# EAGLE design 3rd.try (EAGLE 5.06)
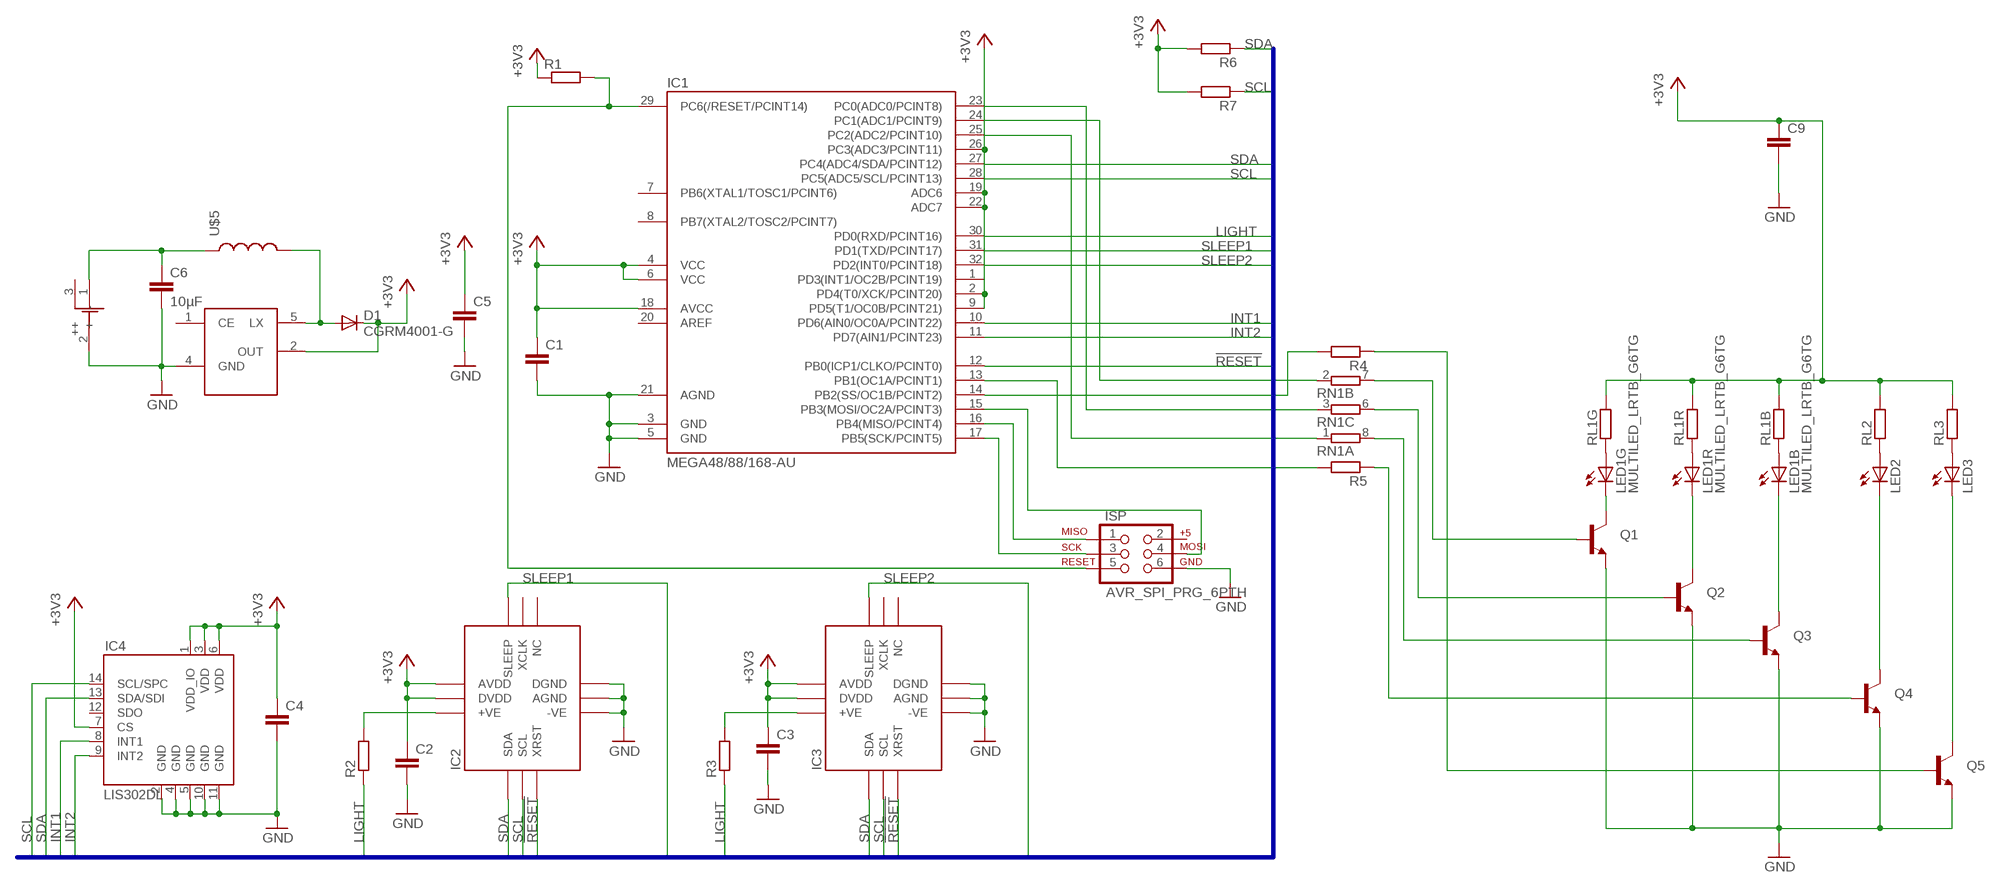
[diagram p0: schematic, sheet 1]

## Parts
C1  C-EUC0402  [C0402]
C2  C-EUC0402  [C0402]
C3  C-EUC0402  [C0402]
C4  C-EUC0402  [C0402]
C5  C-EUC0805  [C0805]
C6  10µF  C-EUC1206  [C1206]
C9  C-EUC0805  [C0805]
D1  CGRM4001-G  [SOD-123_MINI-SMA]
IC1  MEGA48/88/168-AU  [TQFP32-08]
IC2  ADJD_COLOR_SENSOR_SMD  [ADJD-S371]
IC3  ADJD_COLOR_SENSOR_SMD  [ADJD-S371]
IC4  LIS302DL  [LGA14]
ISP  AVR_SPI_PRG_6PTH  [2X3]
LED1  MULTILED_LRTB_G6TG  [P-LCC-6_TOPLED]
LED2  LEDCHIPLED_0603  [CHIPLED_0603]
LED3  LEDCHIPLED_0603  [CHIPLED_0603]
Q1  TRANSISTOR_NPNSOT23  [SOT23]
Q2  TRANSISTOR_NPNSOT23  [SOT23]
Q3  TRANSISTOR_NPNSOT23  [SOT23]
Q4  TRANSISTOR_NPNSOT23  [SOT23]
Q5  TRANSISTOR_NPNSOT23  [SOT23]
R1  R-EU_R0603  [R0603]
R2  R-EU_R0603  [R0603]
R3  R-EU_R0603  [R0603]
R4  R-EU_R0603  [R0603]
R5  R-EU_R0603  [R0603]
R6  R-EU_R0603  [R0603]
R7  R-EU_R0603  [R0603]
RL1B  R-EU_R0805  [R0805]
RL1G  R-EU_R0805  [R0805]
RL1R  R-EU_R0805  [R0805]
RL2  R-EU_R0603  [R0603]
RL3  R-EU_R0603  [R0603]
RN1  4R-NCAY16  [CAY16]
U$2  BATT  [BATTCOM_20MM_PTH]
U$4  NCP1402  [SOT23-5]
U$5  INDUCTORCDRH62B  [CDRH62BNP-470MC]

## Nets
!RESET: IC1.12(PB0(ICP1/CLKO/PCINT0)) IC2.10(XRST) IC3.10(XRST)
+3V3: C1.1 C2.1 C3.1 C4.1 C5.1 C9.1 D1.C IC1.2(PD4(T0/XCK/PCINT20)) IC1.4(VCC) IC1.6(VCC) IC1.9(PD5(T1/OC0B/PCINT21)) IC1.18(AVCC) IC1.19(ADC6) IC1.22(ADC7) IC1.26(PC3(ADC3/PCINT11)) IC2.5(DVDD) IC2.7(AVDD) IC3.5(DVDD) IC3.7(AVDD) IC4.1(VDD_IO) IC4.3(VDD) IC4.6(VDD) IC4.7(CS) R1.1 R6.2 R7.2 RL1B.2 RL1G.2 RL1R.2 RL2.2 RL3.2 U$4.2(OUT)
GND: C1.2 C2.2 C3.2 C4.2 C5.2 C6.2 C9.2 IC1.3(GND) IC1.5(GND) IC1.21(AGND) IC2.1(-VE) IC2.9(AGND) IC2.11(DGND) IC3.1(-VE) IC3.9(AGND) IC3.11(DGND) IC4.2(GND) IC4.4(GND) IC4.5(GND) IC4.10(GND) IC4.11(GND) ISP.6 Q1.2(E) Q2.2(E) Q3.2(E) Q4.2(E) Q5.2(E) U$2.2(-) U$4.4(GND)
INT1: IC1.10(PD6(AIN0/OC0A/PCINT22)) IC4.8(INT1)
INT2: IC1.11(PD7(AIN1/PCINT23)) IC4.9(INT2)
LIGHT: IC1.30(PD0(RXD/PCINT16)) R2.1 R3.1
N$1: IC1.29(PC6(/RESET/PCINT14)) ISP.5 R1.2
N$2: IC1.25(PC2(ADC2/PCINT10)) RN1.1
N$5: IC1.17(PB5(SCK/PCINT5)) ISP.3
N$6: IC1.16(PB4(MISO/PCINT4)) ISP.1
N$10: LED1.C2(G:C) Q1.3(C)
N$11: LED1.C1(R:C) Q2.3(C)
N$12: LED1.C3(B:C) Q3.3(C)
N$13: IC2.3(+VE) R2.2
N$14: IC3.3(+VE) R3.2
N$15: IC1.15(PB3(MOSI/OC2A/PCINT3)) ISP.4
N$16: C6.1 U$2.1(+) U$5.P$1
N$18: LED1.A2(G:A) RL1G.1
N$19: IC1.24(PC1(ADC1/PCINT9)) RN1.2
N$20: D1.A U$4.5(LX) U$5.P$2
N$22: Q1.1(B) RN1.7
N$23: IC1.23(PC0(ADC0/PCINT8)) RN1.3
N$24: Q2.1(B) RN1.6
N$26: Q3.1(B) RN1.8
N$27: LED1.A1(R:A) RL1R.1
N$28: LED2.C Q4.3(C)
N$29: LED3.C Q5.3(C)
N$30: LED1.A3(B:A) RL1B.1
N$31: LED2.A RL2.1
N$32: LED3.A RL3.1
N$33: Q4.1(B) R5.1
N$34: Q5.1(B) R4.1
N$35: IC1.14(PB2(SS/OC1B/PCINT2)) R4.2
N$36: IC1.13(PB1(OC1A/PCINT1)) R5.2
SCL: IC1.28(PC5(ADC5/SCL/PCINT13)) IC2.6(SCL) IC3.6(SCL) IC4.14(SCL/SPC) R7.1
SDA: IC1.27(PC4(ADC4/SDA/PCINT12)) IC2.4(SDA) IC3.4(SDA) IC4.13(SDA/SDI) R6.1
SLEEP1: IC1.31(PD1(TXD/PCINT17)) IC2.8(SLEEP)
SLEEP2: IC1.32(PD2(INT0/PCINT18)) IC3.8(SLEEP)
Unconnected: IC1.1(PD3(INT1/OC2B/PCINT19)) IC1.7(PB6(XTAL1/TOSC1/PCINT6)) IC1.8(PB7(XTAL2/TOSC2/PCINT7)) IC1.20(AREF) IC2.2(NC) IC2.12(XCLK) IC3.2(NC) IC3.12(XCLK) IC4.12(SDO) ISP.2 RN1.4 RN1.5 U$2.3(++) U$4.1(CE)

## Buses
COLOR:SDA,SCL,!RESET,LIGHT,SLEEP1,SLEEP2,INT1,INT2

## Library data of the parts
C1-C6 C9 = rcl:C-EU: CAPACITOR, European symbol
D1 = diode:CGRM400*-G: Molded plasitc,JEDEC SOD-123/Mini SMA Source: Comchip CGRM4001-G.pdf
IC1 = avr-4:MEGA48/88/168
IC2 IC3 = SparkFun:ADJD_COLOR_SENSOR: Color Light Sensor ADJD-S371 from Avago. Digital RGB light sensor (I2C) with on-board white LED. Not quite proven footprint or schematic component. SKU: COM-08618
IC4 = SparkFunB:LIS302DL
ISP = SparkFun:AVR_SPI_PRG_6: AVR ISP 6 Pin This is the reduced ISP connector for AVR programming. Common on Arduino. This footprint will take up less PCB space and can be used with a 10-pin to 6-pin adapter such as SKU: BOB-08508
LED1 = led:MULTILED_LRTB_G6TG: 6-lead MULTILED® Enhanced optical Power LED (ThinFilm® / ThinGaN®) Source. OSRAM - LRTB_G6TG.pdf
LED2 LED3 = led:LED: LED OSRAM: - CHIPLED LG R971, LG N971, LY N971, LG Q971, LY Q971, LO R971, LY R971 LH N974, LH R974 LS Q976, LO Q976, LY Q976 LO Q996 - Hyper CHIPLED LW Q18S LB Q993, LB Q99A, LB R99A - SideLED LS A670, LO A670, LY A670, LG A670, LP A670 LB A673, LV A673, LT A673, LW A673 LH A674 LY A675 LS A676, LA A676, LO A676, LY A676, LW A676 LS A679, LY A679, LG A679 - Hyper Micro SIDELED® LS Y876, LA Y876, LO Y876, LY Y876 LT Y87S - SmartLED LW L88C, LW L88S LB L89C, LB L89S, LG L890 LS L89K, LO L89K, LY L89K LS L896, LA L896, LO L896, LY L896 - TOPLED LS T670, LO T670, LY T670, LG T670, LP T670 LSG T670, LSP T670, LSY T670, LOP T670, LYG T670 LG T671, LOG T671, LSG T671 LB T673, LV T673, LT T673, LW T673 LH T674 LS T676, LA T676, LO T676, LY T676, LB T676, LH T676, LSB T676, LW T676 LB T67C, LV T67C, LT T67C, LS T67K, LO T67K, LY T67K, LW E67C LS E67B, LA E67B, LO E67B, LY E67B, LB E67C, LV E67C, LT E67C LW T67C LS T679, LY T679, LG T679 LS T770, LO T770, LY T770, LG T770, LP T770 LB T773, LV T773, LT T773, LW T773 LH T774 LS E675, LA E675, LY E675, LS T675 LS T776, LA T776, LO T776, LY T776, LB T776 LHGB T686 LT T68C, LB T68C - Hyper Mini TOPLED® LB M676 - Mini TOPLED Santana® LG M470 LS M47K, LO M47K, LY M47K Source: http://www.osram.convergy.de LUXEON: - LUMILED® LXK2-PW12-R00, LXK2-PW12-S00, LXK2-PW14-U00, LXK2-PW14-V00 LXK2-PM12-R00, LXK2-PM12-S00, LXK2-PM14-U00 LXK2-PE12-Q00, LXK2-PE12-R00, LXK2-PE12-S00, LXK2-PE14-T00, LXK2-PE14-U00 LXK2-PB12-K00, LXK2-PB12-L00, LXK2-PB12-M00, LXK2-PB14-N00, LXK2-PB14-P00, LXK2-PB14-Q00 LXK2-PR12-L00, LXK2-PR12-M00, LXK2-PR14-Q00, LXK2-PR14-R00 LXK2-PD12-Q00, LXK2-PD12-R00, LXK2-PD12-S00 LXK2-PH12-R00, LXK2-PH12-S00 LXK2-PL12-P00, LXK2-PL12-Q00, LXK2-PL12-R00 Source: www.luxeon.com KINGBRIGHT: KA-3528ASYC Source: www.kingbright.com
Q1-Q5 = SparkFun:TRANSISTOR_NPN: Transistor NPN BJT configuration in SOT23 package. MMBT2222 is the common NPN we use. Double check BCE configuration again layout.
R1-R7 RL1B RL1G RL1R RL2 RL3 = rcl:R-EU_: RESISTOR, European symbol
RN1 = resistor-dil:4R-N: Array Chip Resistor Source: RS Component / Phycomp
U$2 = additional:BATT
U$4 = additional:NCP1402
U$5 = additional:INDUCTOR: Inductors Basic Inductor/Choke - 0603 and 1206. Footprints are not proven and vary greatly between part numbers.

## Board
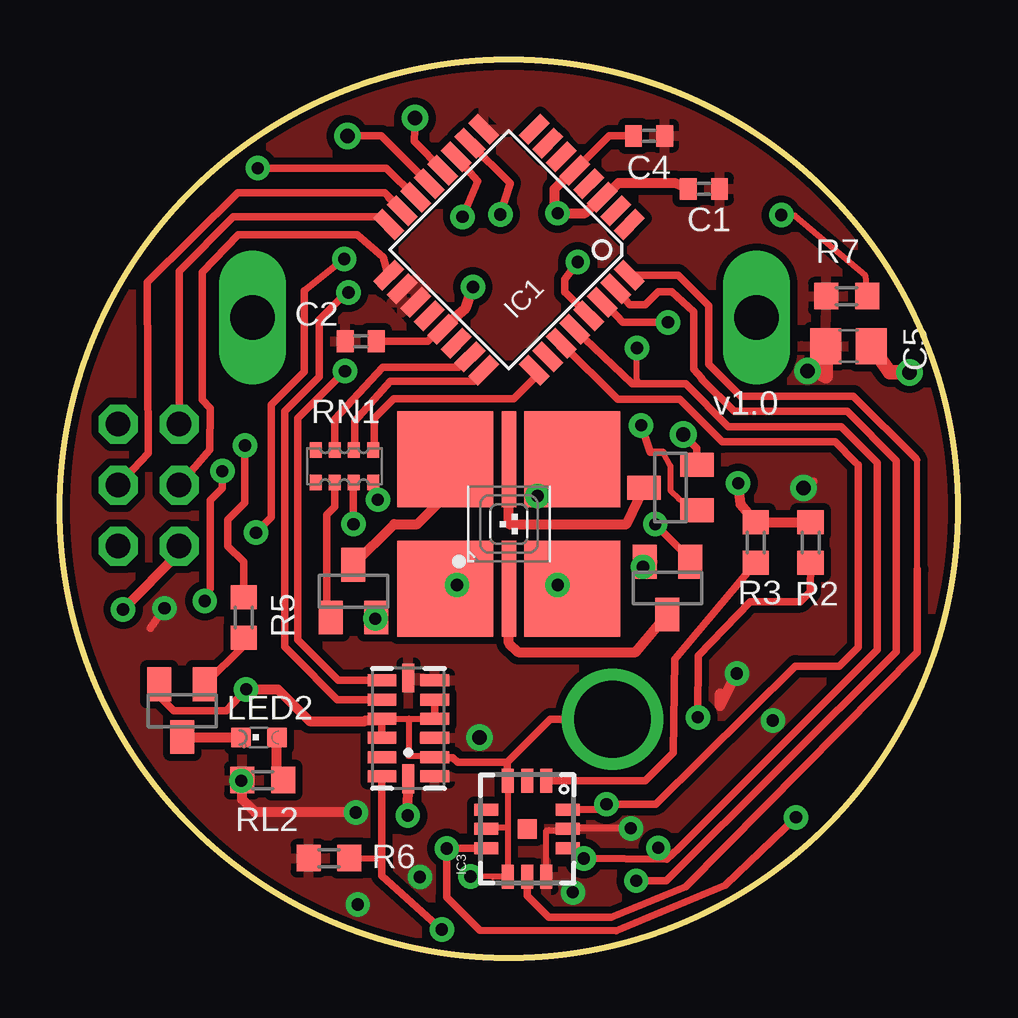
[diagram p1: board, top side]
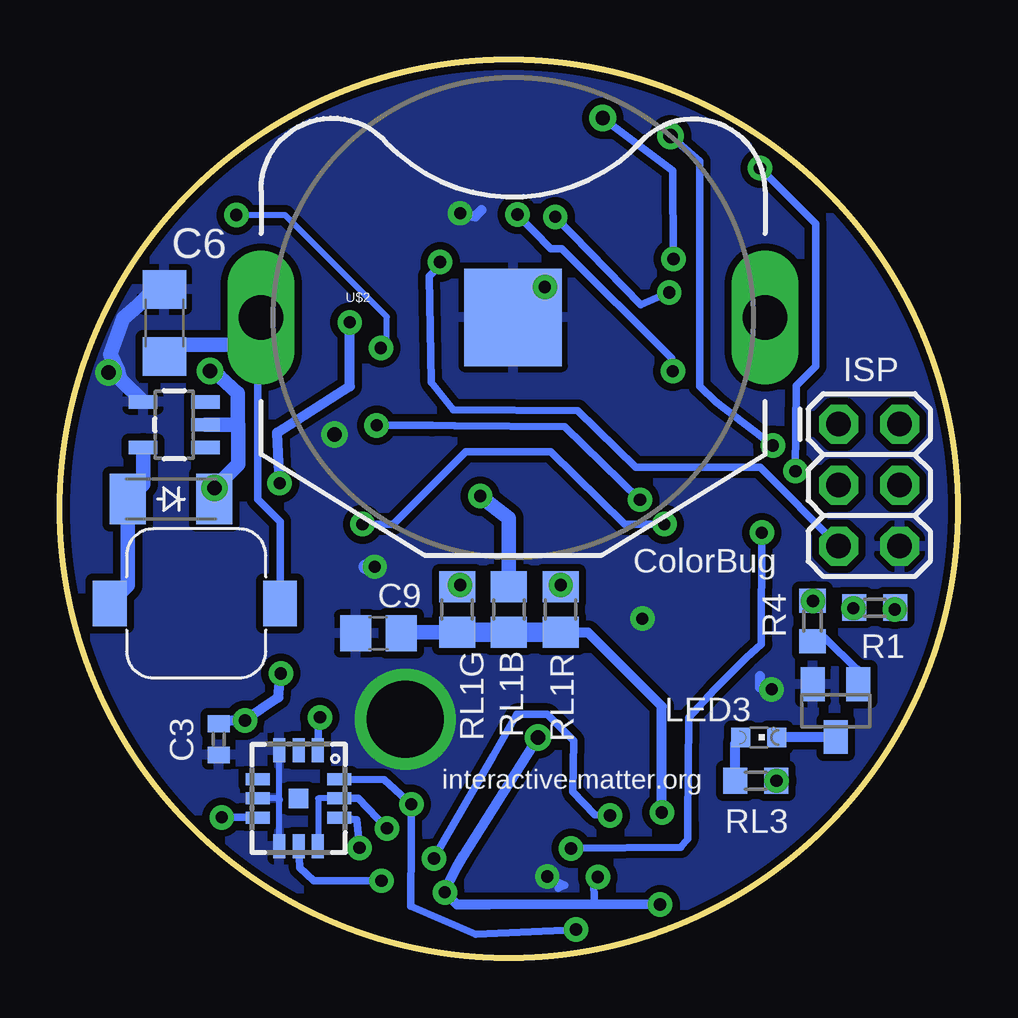
[diagram p2: board, bottom side, seen from below]

Size 37.41 x 37.41 mm. Coordinates in mm from the lower left corner, seen from the top.
Outline: circle at 18.7,18.7 radius 18.7
Copper layers (1*16): Top 0.035mm / dielectric 1.5mm / Bottom 0.035mm
Design rules "SparkFun *": minimum track width 8mil, minimum drill 20mil, track to track 8mil, track to pad 8mil, pad to pad 8mil, via to via 8mil, smd to smd 0mil, copper to edge 10mil, drill to drill 8mil, minimum pad ring 12mil, minimum via ring 10mil, stop-mask expansion 4mil, vias tented up to drill 25mil, thermal gap 10mil

### Footprints (pad centres in the part's own frame; a part is rotated, then mirrored left to right if it is on the bottom)
C0402 = smd 0.7 x 0.9: 1 -0.65,0; 2 0.65,0
C0805 = smd 1.3 x 1.5: 1 -0.95,0; 2 0.95,0
C1206 = smd 1.6 x 1.8: 1 -1.4,0; 2 1.4,0
SOD-123_MINI-SMA = smd 1.5 x 2.1: A 1.8,0; C -1.8,0
TQFP32-08 = smd 1.27 x 0.559: 1 -4.293,2.8; 2 -4.293,2; 3 -4.293,1.2; 4 -4.293,0.4; 5 -4.293,-0.4; 6 -4.293,-1.2; 7 -4.293,-2; 8 -4.293,-2.8; 17 4.293,-2.8; 18 4.293,-2; 19 4.293,-1.2; 20 4.293,-0.4; 21 4.293,0.4; 22 4.293,1.2; 23 4.293,2; 24 4.293,2.8 | smd 0.559 x 1.27: 9 -2.8,-4.293; 10 -2,-4.293; 11 -1.2,-4.293; 12 -0.4,-4.293; 13 0.4,-4.293; 14 1.2,-4.293; 15 2,-4.293; 16 2.8,-4.293; 25 2.8,4.293; 26 2,4.293; 27 1.2,4.293; 28 0.4,4.293; 29 -0.4,4.293; 30 -1.2,4.293; 31 -2,4.293; 32 -2.8,4.293
ADJD-S371 = smd 1 x 0.5: 1 2,0.8; 2 2,0; 3 2,-0.8; 7 -2,-0.8; 8 -2,0; 9 -2,0.8 | smd 0.5 x 1: 4 0.8,-1.7; 5 0,-1.7; 6 -0.8,-1.7; 10 -0.8,1.7; 11 0,1.7; 12 0.8,1.7 | smd 0.8 x 0.8: PAD 0,0
LGA14 = smd 0.5 x 1.2: 1 2,1.1; 2 1.2,1.1; 3 0.4,1.1; 4 -0.4,1.1; 5 -1.2,1.1; 6 -2,1.1; 8 -2,-1.1; 9 -1.2,-1.1; 10 -0.4,-1.1; 11 0.4,-1.1; 12 1.2,-1.1; 13 2,-1.1 | smd 1.2 x 0.5: 7 -2.1,0; 14 2.1,0
2X3 = drill 1.016 octagon: 1 0,0; 2 0,2.54; 3 2.54,0; 4 2.54,2.54; 5 5.08,0; 6 5.08,2.54
P-LCC-6_TOPLED = smd 4 x 4: A1 -2.65,-2.7; A2 2.65,-2.7; A3 2.65,2.7; C1 -2.65,2.7 | smd 0.6 x 4: C2 0,-2.7; C3 0,2.7
CHIPLED_0603 = smd 0.8 x 0.8: A 0,-0.75; C 0,0.75
SOT23 = smd 1 x 1.4: 1 -0.95,-1.1; 2 0.95,-1.1; 3 0,1.1
R0603 = smd 1 x 1.1: 1 -0.85,0; 2 0.85,0
R0805 = smd 1.3 x 1.5: 1 -0.95,0; 2 0.95,0
CAY16 = smd 0.5 x 0.65: 1 -1.2,-0.675; 2 -0.4,-0.675; 3 0.4,-0.675; 4 1.2,-0.675; 5 1.2,0.675; 6 0.4,0.675; 7 -0.4,0.675; 8 -1.2,0.675
BATTCOM_20MM_PTH = drill 1.854 long: 1 -10.5,0; 3 10.5,0 | smd 4.064 x 4.064: 2 0,0
SOT23-5 = smd 0.55 x 1.2: 1 -0.95,-1.3; 2 0,-1.3; 3 0.95,-1.3; 4 0.95,1.3; 5 -0.95,1.3
CDRH62BNP-470MC = smd 1.9 x 1.4: P$1 0,-3.5; P$2 0,3.6

### Placement (x,y rotation side)
C1  26.83,32.04 180 top
C2  12.53,25.69 0 top
C3  30.79,9.1 270 bottom
C4  24.55,34.25 180 top
C5  32.85,25.49 0 top
C6  33.05,26.45 90 bottom
C9  24.14,13.52 180 bottom
D1  32.78,19.11 180 bottom
IC1  18.7,29.5 225 top
IC2  27.47,6.64 90 bottom
IC3  19.47,5.37 90 top
IC4  14.51,9.56 270 top
ISP  4.96,22.23 270 bottom
LED1  18.7,18.07 0 top
LED2  8.29,9.18 90 top
LED3  8.29,9.18 270 bottom
Q1  25.31,15.4 180 top
Q2  12.23,15.27 0 top
Q3  25.43,19.59 90 top
Q4  5.09,10.3 180 top
Q5  5.09,10.3 180 bottom
R1  3.46,14.59 0 bottom
R2  31.28,17.31 270 top
R3  28.99,17.31 270 top
R4  6.05,14.03 90 bottom
R5  7.65,14.18 90 top
R6  11.21,4.15 180 top
R7  32.78,27.57 180 top
RL1B  18.7,14.51 270 bottom
RL1G  20.86,14.51 270 bottom
RL1R  16.54,14.51 270 bottom
RL2  8.44,7.4 180 top
RL3  8.42,7.38 0 bottom
RN1  11.85,20.48 180 top
U$2  18.53,26.68 0 bottom
U$4  32.65,22.21 90 bottom
U$5  31.73,14.77 90 bottom

### Tracks (layer width: path | path; a pad name or v marks a point on that pad's centre or on a via)
!RESET  (via drill 0.51, 0.6)
  Top 0.305: IC3.10 17.75,4.56 v16.11,4.56 16.11,2.52 17.48,1.15 23.17,1.13 27.72,3.03 v30.67,5.85 | v11.85,29.12 10.17,27.8 10.17,24.42 8.8,23.05 8.8,18.35 v8.16,17.71 | v14.79,34.98 14.77,34.03 IC1.12
  Bottom 0.305: v8.16,17.71 8.19,13.06 8.82,12.51 10.14,11.16 11.21,9.99 11.26,5.67 11.26,4.96 11.54,4.61 v16.11,4.56 | IC2.10 v30.67,5.85 | v11.85,29.12 11.87,32.8 v14.79,34.98
+3V3  (via drill 0.51, 0.6)
  Top 0.254: 21.11,5.32 20.38,5.32 20.27,5.31 IC3.7
  Top 0.305: 21.11,5.32 IC3.5 21.22,5.42 v23.78,5.39 | 3.77,13.73 v4.35,14.56 | IC3.7 20.28,3.39 | v30.97,19.57 31.33,19.77 31.4,19.85
  Top 0.406: v28.2,11.85 27.49,10.5 27.49,11.01 | v12.33,6.05 12.3,6.08 8.11,6.08 7.59,6.6 RL2.2 7.59,7.48 v7.55,7.38
  Top 0.61: C5.1 31.9,24.28 31.91,24.24 31.45,24.49 v31.15,24.44
  Bottom 0.254: IC2.5 26.65,6.64 26.65,4.65
  Bottom 0.305: 26.65,4.65 IC2.7 | IC2.5 24.98,6.64 v23.78,5.39 | v15,3.36 15.17,2.96 15.12,2.24 | R1.1 v4.35,14.56 4.35,14.54 | D1.C 30.98,19.67 v30.97,19.57
  Bottom 0.406: v17.48,9.18 20.58,4.28 arc-11 v21.37,2.73 20.86,2.22 19.54,2.22 15.12,2.24 v12.4,2.22 | C3.1 30.17,9.89 29.73,9.89 | 29.73,9.89 28.3,10.85 v28.2,11.85 | v29.7,9.89 29.73,9.89 | v12.33,6.05 12.33,10.47 15.4,13.55 16.53,13.55 RL1R.2 | v7.55,7.38 RL3.2
  Bottom 0.61: RL1G.2 23.15,13.56 C9.1 | 30.08,22.21 29.98,22.21 29.98,20.56 v30.97,19.57 | 30.08,22.21 U$4.2 | v31.15,24.44 30.74,24.22 30.01,23.53 30.01,22.28 30.08,22.21
  Bottom 0.813: RL1R.2 RL1B.2 RL1G.2
  pour Top (isolate 0.305): -0.98,37.12 37.7,37.5 38.77,-0.73 -0.35,-1.62 -1.36,33.94 -1.36,34.07
GND  (via drill 0.51, 0.6, 3.2)
  Top 0.254: v17.1,3.39 18.05,3.37 IC3.9 18.67,5.42 | IC3.1 18.67,5.42 | 18.67,5.42 17.82,5.42 | IC4.10 14.54,9.96 | 14.54,9.96 IC4.4 | 15.56,8.42 14.51,8.42 14.54,8.44 14.54,9.96
  Top 0.305: IC4.10 IC4.11 | IC4.4 IC4.5 | IC3.1 18.63,7.41 18.63,8.14 | 18.63,8.14 20.43,9.94 v23.02,9.94 | 17.82,5.42 IC3.11 | 15.56,8.42 IC4.2 15.63,8.34 16.37,8.34 16.57,8.14 18.63,8.14 | C4.2 22.89,34.25 IC1.5 | 15.89,26.18 15.82,26.18 15.33,25.69 C2.2 | 4.15,10.88 4.73,10.3 6.92,10.3 v7.76,11.19 | Q3.2 26.53,21.24 v25.97,21.8
  Top 0.406: IC1.5 21.39,32.82 20.61,32.04 20.61,31.28 v20.74,31.02 21.88,31.02 22.54,31.69 IC1.3 22.67,31.69 23.28,32.29 25.63,32.29 C1.2 | IC1.21 15.89,26.18 16.9,27.06 v17.2,27.95 | Q2.2 13.21,14.17 v13.14,14.13 | IC4.10 13.34,9.89 12.73,9.89 12.71,9.86 10.4,9.86 9.08,11.19 v7.76,11.19 | Q4.2 4.15,11.39 4.15,10.88
  Top 0.61: Q1.2 24.59,16.5 v24.29,16.29 | C5.2 34.56,24.39 v35.39,24.39
  Bottom 0.254: IC2.9 28.27,6.59 IC2.1 | 28.32,6.64 IC2.11
  Bottom 0.305: v17.1,3.39 16.37,3.03 16.65,2.9 | 28.27,6.59 28.32,6.64 | 18.09,27.06 18.09,26.68 | v25.97,21.8 25.97,21.88 25.71,22.13
  Bottom 0.406: v20.74,31.02 20.1,30.9 19.85,31.15 | 17.69,27.47 v17.2,27.95 18.09,27.06 18.45,26.7 | v13.14,14.13 13.06,13.85 13.17,13.88 | v7.76,11.19 8.24,11.26 8.24,11.74
  Bottom 0.61: v24.29,16.29 24.29,16.16 24.67,16.29 | U$4.4 34.88,24.09 34.98,24.44 | 34.98,24.44 35.32,25.16 34.78,26.65 34.17,27.16 33.33,28 C6.2 | v35.39,24.39 35.57,24.44 34.98,24.44
  pour Bottom (isolate 0.305): -1.87,-3.01 -1.24,37.25 37.75,37.55 38.39,-1.49
INT1  (via drill 0.51)
  Top 0.305: IC4.8 11.6,11.56 10.22,12.94 9.92,13.24 9.92,22.49 v11.87,24.44 | v18.35,30.97 18.75,32.28 IC1.10
  Bottom 0.305: v11.87,24.44 11.92,24.98 16.49,29.55 16.95,29.55 v18.35,30.97
INT2  (via drill 0.51)
  Top 0.305: IC4.9 11.56,10.76 9.7,12.62 | 9.7,12.62 9.53,12.79 | v16.77,30.87 17.41,32.36 IC1.11 | v12.02,27.72 11.95,27.72 10.8,26.58 10.8,24.22 9.36,22.77 9.36,12.96 9.7,12.62
  Bottom 0.305: v12.02,27.72 13.22,27.21 v16.77,30.87
LIGHT  (via drill 0.51)
  Top 0.305: 22.69,27.29 23.45,26.48 v25.33,26.48
  Top 0.406: v28.25,19.77 28.36,18.89 R3.1 R2.1 | 22.69,27.29 IC1.30
  Bottom 0.406: v28.25,19.77 28.36,21.88 25.33,23.81 v25.33,26.48
N$1  (via drill 0.51)
  Top 0.305: v21.57,28.99 21.04,28.28 21.04,27.72 21.05,27.72 IC1.29
  Top 0.406: ISP.5 4.96,16.87 v2.63,14.51
  Bottom 0.305: ISP.5 8.24,20.43 13.42,20.43 15.83,22.79 21.01,22.84 21.93,23.99 22.03,28.41 21.37,29.07 v21.57,28.99
  Bottom 0.406: v2.63,14.51 2.7,14.42 R1.2
N$2
  Top 0.305: IC1.25 19.76,24.15 18.91,23.3 13.9,23.3 13.09,22.49 13.09,21.2 RN1.1
N$5
  Top 0.305: IC1.17 13.47,29.19 12.38,30.13 7.43,30.13 5.93,28.56 5.93,23.25 6.26,22.89 6.23,21.17 ISP.3
N$6
  Top 0.305: ISP.1 4.96,28.61 7.22,30.87 13.37,30.87 IC1.16
N$10
  Top 0.406: LED1.C2 18.7,13.12 19.08,12.73 23.99,12.73 Q1.3
N$11
  Top 0.406: Q2.3 13.92,18.07 14.89,18.07 16.05,19.23 LED1.C1
N$12
  Top 0.406: LED1.C3 18.7,18.07 23.61,18.07 Q3.3
N$13  (via drill 0.51)
  Top 0.305: R2.2 31.25,15.25 30.84,14.84 28.76,14.84 26.6,12.58 v26.58,10.02
  Bottom 0.305: v26.58,10.02 26.64,9.42 IC2.3
N$14
  Top 0.305: R3.2 25.61,12.44 25.56,8.54 24.39,7.37 IC3.3
N$15
  Top 0.305: 14.24,31.12 IC1.15 | 14.24,31.12 13.7,31.66 | 14.24,31.12 14.24,31.17 13.52,31.89 7.4,31.89 3.64,28.15 3.67,21.01 ISP.4
N$16
  Bottom 0.305: U$5.P$1 28.23,18.18 29.17,19.11 29.17,25.13 29.03,25.27
  Bottom 0.61: C6.1 32.27,25.54 29.5,25.54 29.03,25.27 U$2.1
N$18  (via drill 0.51)
  Top 0.61: v20.74,15.53 21.19,15.53 LED1.A2
  Bottom 0.61: RL1G.1 20.8,15.46 v20.74,15.53
N$19
  Top 0.305: IC1.24 17.65,24.4 17.26,24.01 13.75,24.01 12.28,22.36 12.28,21.19 RN1.2
N$20
  Bottom 0.61: U$5.P$2 34.58,15.53 D1.A 33.95,19.74 U$4.5
N$22  (via drill 0.51)
  Top 0.305: RN1.7 12.23,19.79 v12.23,18.07 | v24.8,18.07 26.26,16.61 Q1.1
  Bottom 0.305: v12.23,18.07 13.88,18.07 16.95,21.09 20.51,21.09 23.53,18.07 v24.8,18.07
N$23
  Top 0.305: IC1.23 17.02,25.05 16.62,24.6 13.45,24.6 11.44,22.44 11.44,21.23 RN1.3
N$24
  Top 0.305: Q2.1 11.11,14.34 11.11,18.45 11.45,18.79 RN1.6
N$26  (via drill 0.51)
  Top 0.254: 25.1,21.07 25.43,20.48 25.43,19.47 25.77,19.13 Q3.1
  Top 0.305: RN1.8 13.24,19.36 v13.24,19.08 | v24.22,22.18 24.6,21.07 25.1,21.07
  Bottom 0.305: v13.24,19.08 16.37,22.13 20.96,22.16 21.9,22.18 v24.22,22.18
N$27  (via drill 0.51)
  Top 0.61: v16.54,15.53 16.34,15.66 LED1.A1
  Bottom 0.61: RL1R.1 16.73,15.46 16.8,15.53 v16.54,15.53
N$28
  Top 0.406: Q4.3 7.53,9.2 LED2.C
N$29
  Bottom 0.406: Q5.3 7.54,9.2 LED3.C
N$30  (via drill 0.51)
  Top 0.61: v19.9,19.24 20.56,19.14 LED1.A3
  Bottom 0.61: RL1B.1 18.7,18.32 v19.9,19.24
N$31
  Top 0.406: LED2.A 9.04,7.4 RL2.1
N$32
  Bottom 0.406: RL3.1 9.27,8.95 LED3.A
N$33
  Top 0.305: R5.1 7.65,13.01 Q4.1
N$34
  Bottom 0.305: R4.1 5.53,13.33 4.17,11.97
  Bottom 0.406: 4.17,11.97 Q5.1
N$35  (via drill 0.51)
  Top 0.305: v8.24,32.9 13.6,32.9 IC1.14 | v6.77,20.28 6.77,19.57 6.26,19.06 6.26,15.38 v6.03,14.87
  Bottom 0.305: v6.77,20.28 6.74,23.83 5.93,24.65 5.93,30.59 v8.24,32.9 | v6.03,14.87 6.03,15.06 R4.2
N$36  (via drill 0.51, 0.6)
  Top 0.305: v11.97,34.25 13.39,34.25 IC1.13 | R5.2 7.65,16.49 6.99,17.15 6.99,18.25 7.71,18.96 v7.71,21.35
  Bottom 0.305: v7.71,21.35 10.09,23.17 10.75,23.81 10.75,33.18 v11.97,34.25
SCL  (via drill 0.51)
  Top 0.254: R7.1 33.55,28.45 30.62,30.92 v30.06,30.95 | v24.04,25.41 24.04,24.09 24.22,23.91
  Top 0.305: v21.83,4.14 IC3.6 v21.83,4.14 | v21.83,4.14 25.28,4.11 | 25.28,4.11 25.78,4.57 34.05,12.84 34.05,20.63 32.55,22.13 27.85,22.13 26.07,23.91 24.22,23.91 23.85,23.91 IC1.28 | 25.28,4.11 v24.93,4.58
  Top 0.406: v14.49,5.93 IC4.14
  Bottom 0.254: v24.04,25.41 23.78,25.66 23.78,26.7 28.03,30.95 v30.06,30.95
  Bottom 0.305: IC2.6 25.04,5.75 v24.93,4.58 | v14.49,5.93 15.12,5.95 16.04,6.92 16.01,9.05 17.1,10.14 18.37,10.14 19.36,8.42 v21.83,4.14
SDA  (via drill 0.51)
  Top 0.254: R6.1 13.41,4.15 13.41,4.1
  Top 0.305: IC3.4 22.44,6.18 v22.77,6.4 24.81,6.4 30.64,12.15 32.47,12.15 33.25,12.93 33.25,20.54 33.14,20.65 32.29,21.5 27.59,21.5 25.82,23.28 23.23,23.28 IC1.27 | IC4.13 13.41,4.1 13.41,3.42 v15.91,1.18
  Bottom 0.305: IC2.4 23.89,7.41 v22.77,6.4 22.77,4.95 22.79,2.14 20.08,0.97 v15.91,1.18
SLEEP1  (via drill 0.51)
  Top 0.305: v24.01,3.21 25.26,3.21 34.85,12.75 34.85,20.72 32.8,22.77 28.1,22.77 26.73,24.11 26.73,24.14 26.4,24.52 26.4,26.91 25.49,27.75 24.93,27.75 24.39,27.21 23.74,27.21 IC1.31
  Bottom 0.305: v24.01,3.21 26.83,3.21 27.42,3.74 IC2.8
SLEEP2
  Top 0.254: 35.72,16.18 35.72,20.74 35.65,20.81
  Top 0.305: 35.72,16.18 35.72,12.73 27.75,4.66 26.07,2.96 22.97,1.69 20.35,1.69 19.47,2.57 IC3.8 | 35.65,20.81 33.05,23.4 28.36,23.4 27.03,24.72 27.03,27.16 25.75,28.44 IC1.32

### Text on the board
tNames: v1.0
bNames: ColorBug | interactive-matter.org